# EAGLE design 301_Photodiode_Board Rev.2 (EAGLE 9.6.2)
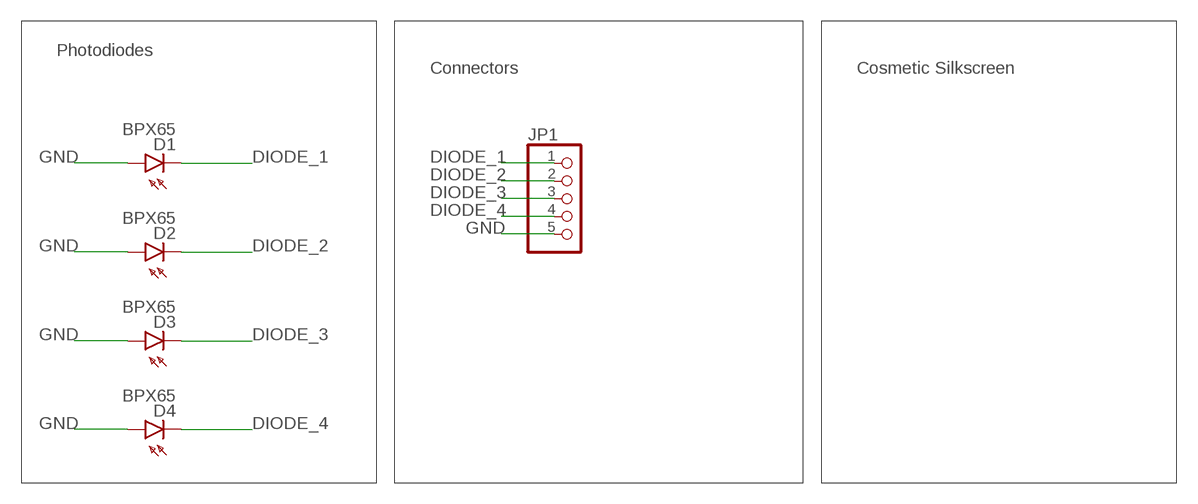
[diagram p0: schematic, sheet 1]

## Parts
D1  BPX65  [BPX65]
D2  BPX65  [BPX65]
D3  BPX65  [BPX65]
D4  BPX65  [BPX65]
JP1  PINHD-1X5  [1X05]

## Nets
DIODE_1: D1.K(C) JP1.1
DIODE_2: D2.K(C) JP1.2
DIODE_3: D3.K(C) JP1.3
DIODE_4: D4.K(C) JP1.4
GND: D1.A D2.A D3.A D4.A JP1.5

## Notes on the sheet
- Photodiodes
- Connectors | Cosmetic Silkscreen

## Library data of the parts
D1-D4 = 301 photodiode board -- larger pads:BPX65: PHOTO DIODE; MPN: BPX65.; OC_FARNELL: 327451; OC_NEWARK: 06WX2764
JP1 = pinhead:PINHD-1X5: PIN HEADER

## Board
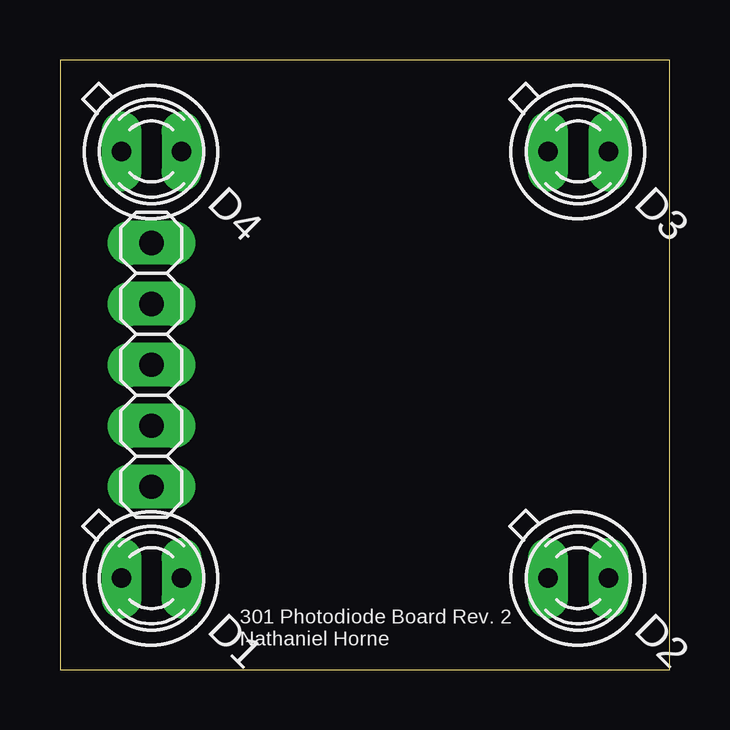
[diagram p1: board, top side]
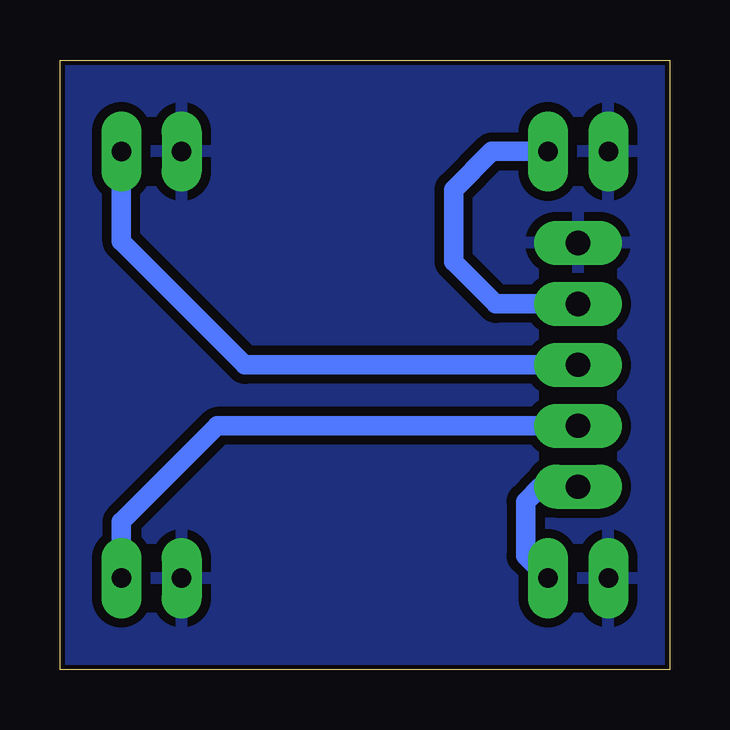
[diagram p2: board, bottom side, seen from below]

Size 25.4 x 25.4 mm. Coordinates in mm from the lower left corner, seen from the top.
Outline: 0,0 25.4,0 25.4,25.4 0,25.4 0,0
Copper layers (1*16): Top 0.035mm / dielectric 1.6mm / Bottom 0.035mm
Design rules "jlcpcb-2layers *": minimum track width 5mil, minimum drill 0.3mm, track to track 15mil, track to pad 15mil, pad to pad 15mil, via to via 15mil, smd to smd 15mil, copper to edge 0.2mm, drill to drill 6mil, minimum pad ring 10mil, minimum via ring 3mil, stop-mask expansion 4mil, vias tented up to drill 0mil, thermal gap 15mil

### Footprints (pad centres in the part's own frame; a part is rotated, then mirrored left to right if it is on the bottom)
BPX65 = drill 0.813 pad 1.676 long: A -0.889,-0.889; K 0.889,0.889
1X05 = drill 1.016 long: 1 -5.08,0; 2 -2.54,0; 3 0,0; 4 2.54,0; 5 5.08,0

### Placement (x,y rotation side)
D1  3.81,3.81 315 top
D2  21.59,3.81 315 top
D3  21.59,21.59 315 top
D4  3.81,21.59 315 top
JP1  3.81,12.7 90 top

### Tracks (layer width: path | path; a pad name or v marks a point on that pad's centre or on a via)
DIODE_1
  Bottom 0.813: JP1.1 5.38,7.62 6,7 6,4.74 D1.K
DIODE_2
  Bottom 0.813: JP1.2 18.84,10.16 22.85,6.15 D2.K
DIODE_3
  Bottom 0.813: JP1.3 17.7,12.7 22.85,17.85 D3.K
DIODE_4
  Bottom 0.813: JP1.4 7.24,15.24 9,17 9,20 7.41,21.59 D4.K
GND
  pour Bottom: -1,27 -1,-1 27,-1 27,27

### Text on the board
tNames: 301 Photodiode Board Rev. 2 / Nathaniel Horne